# EAGLE design SnowFlake (EAGLE 9.6.2)
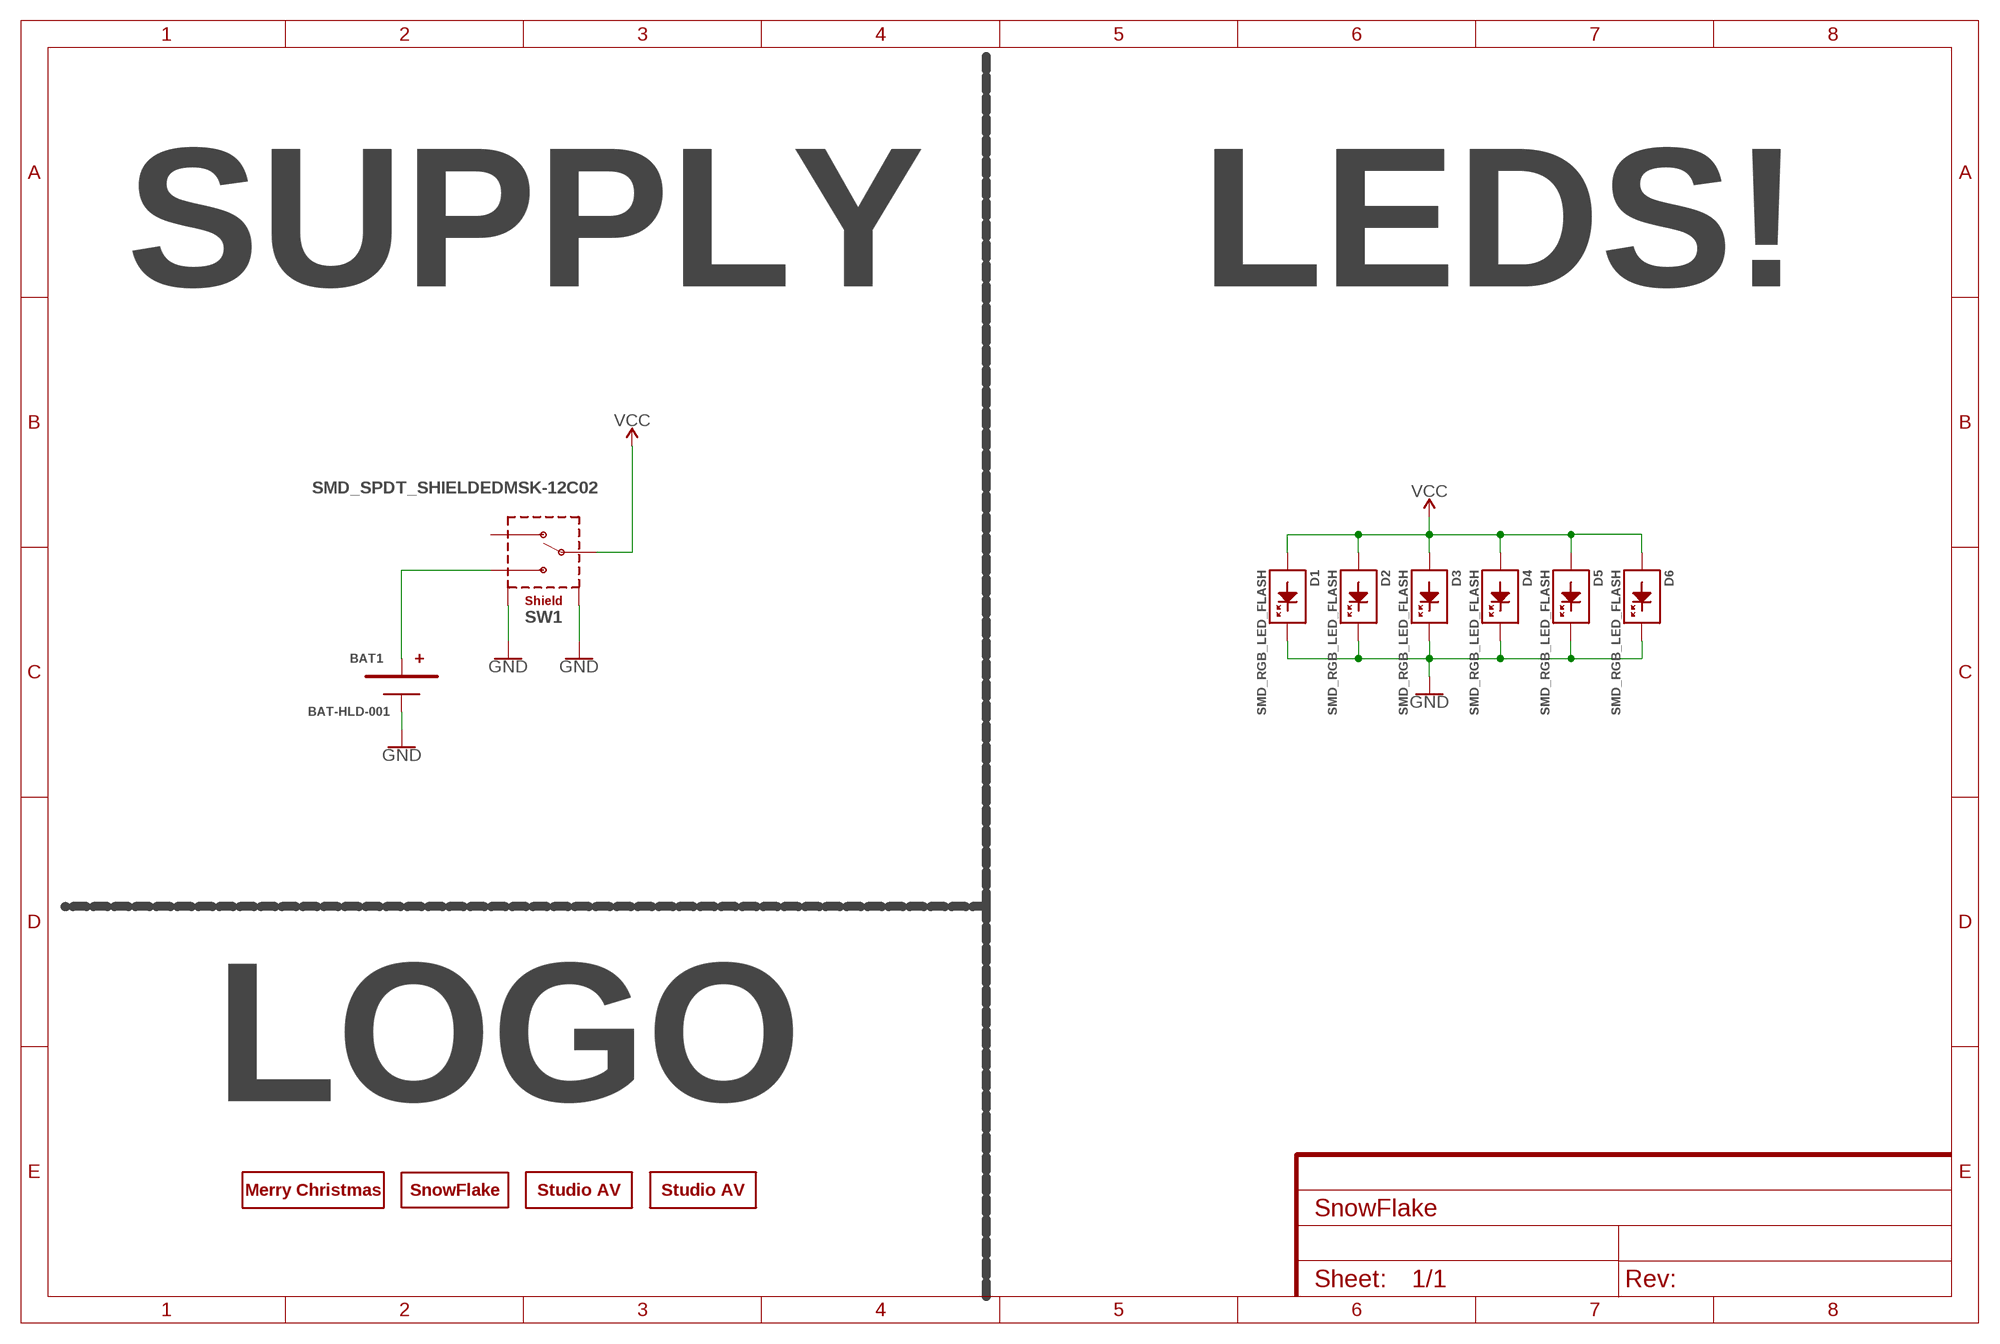
[diagram p0: schematic, sheet 1]

## Parts
BAT1  BAT-HLD-001  [BATHLD001]
D1  SMD_RGB_LED_FLASH  [SMD_RGB_LED_0807]
D2  SMD_RGB_LED_FLASH  [SMD_RGB_LED_0807]
D3  SMD_RGB_LED_FLASH  [SMD_RGB_LED_0807]
D4  SMD_RGB_LED_FLASH  [SMD_RGB_LED_0807]
D5  SMD_RGB_LED_FLASH  [SMD_RGB_LED_0807]
D6  SMD_RGB_LED_FLASH  [SMD_RGB_LED_0807]
SW1  SMD_SPDT_SHIELDEDMSK-12C02  [MSK-12C02]
U$1  MERRY_CHRISTMAS  [MERRY_CHRISTMAS]
U$2  STUDIO_AV-QR_CODE  [STUDIO_AV_QR]
U$3  STUDIO_AV-GENERAL  [STUDIO_AV]
U$4  SNOWFLAKE  [SNOWFLAKE]

## Nets
GND: BAT1.3(N) D1.3(K) D1.4(K) D2.3(K) D2.4(K) D3.3(K) D3.4(K) D4.3(K) D4.4(K) D5.3(K) D5.4(K) D6.3(K) D6.4(K) SW1.GND@1(S1) SW1.GND@2(S2) SW1.GND@3(S1) SW1.GND@4(S2)
N$2: BAT1.1(P) BAT1.2(P) SW1.L2(NO)
VCC: D1.1(A) D1.2(A) D2.1(A) D2.2(A) D3.1(A) D3.2(A) D4.1(A) D4.2(A) D5.1(A) D5.2(A) D6.1(A) D6.2(A) SW1.COM(C)
Unconnected: SW1.L1(NC)

## Notes on the sheet
- SUPPLY | LEDS!
- LOGO

## Library data of the parts
BAT1 = FL-Battery:BAT-HLD-001: Soporte para baterías de botón Linx CR2032 Battery Holder, Tape n Reel; DATASHEET: https://www.mouser.mx/datasheet/2/238/bat_hld_001-1659379.pdf; LCSC#PART: -; MANUFACTURER#PART: BAT-HLD-001-TR; MANUFACTURER_NAME: Linx Technologies; MOUSER#PART: 712-BAT-HLD-001-TR; PACKAGE: SMD
D1-D6 = FL-Led:SMD_RGB_LED_FLASH: 0807 RGB Led Lamp SMD, RGB Slow Flashing Diode, Colorful Diodes, DIY Flash; DATASHEET: https://es.aliexpress.com/item/32829140495.html?spm=a2g0s.9042311.0.0.32vRd6; LCSC#PART: -; MANUFACTURER#PART: -; MANUFACTURER_NAME: -; MOUSER#PART: -; PACKAGE: 0807
SW1 = FL-Switches:SMD_SPDT_SHIELDED: Interruptores corredizos SLIDE SWITCH SPDT Right Angle
U$1 = FL-Logo:MERRY_CHRISTMAS
U$2 U$3 = FL-Logo:STUDIO_AV
U$4 = FL-Boards:SNOWFLAKE

## Board
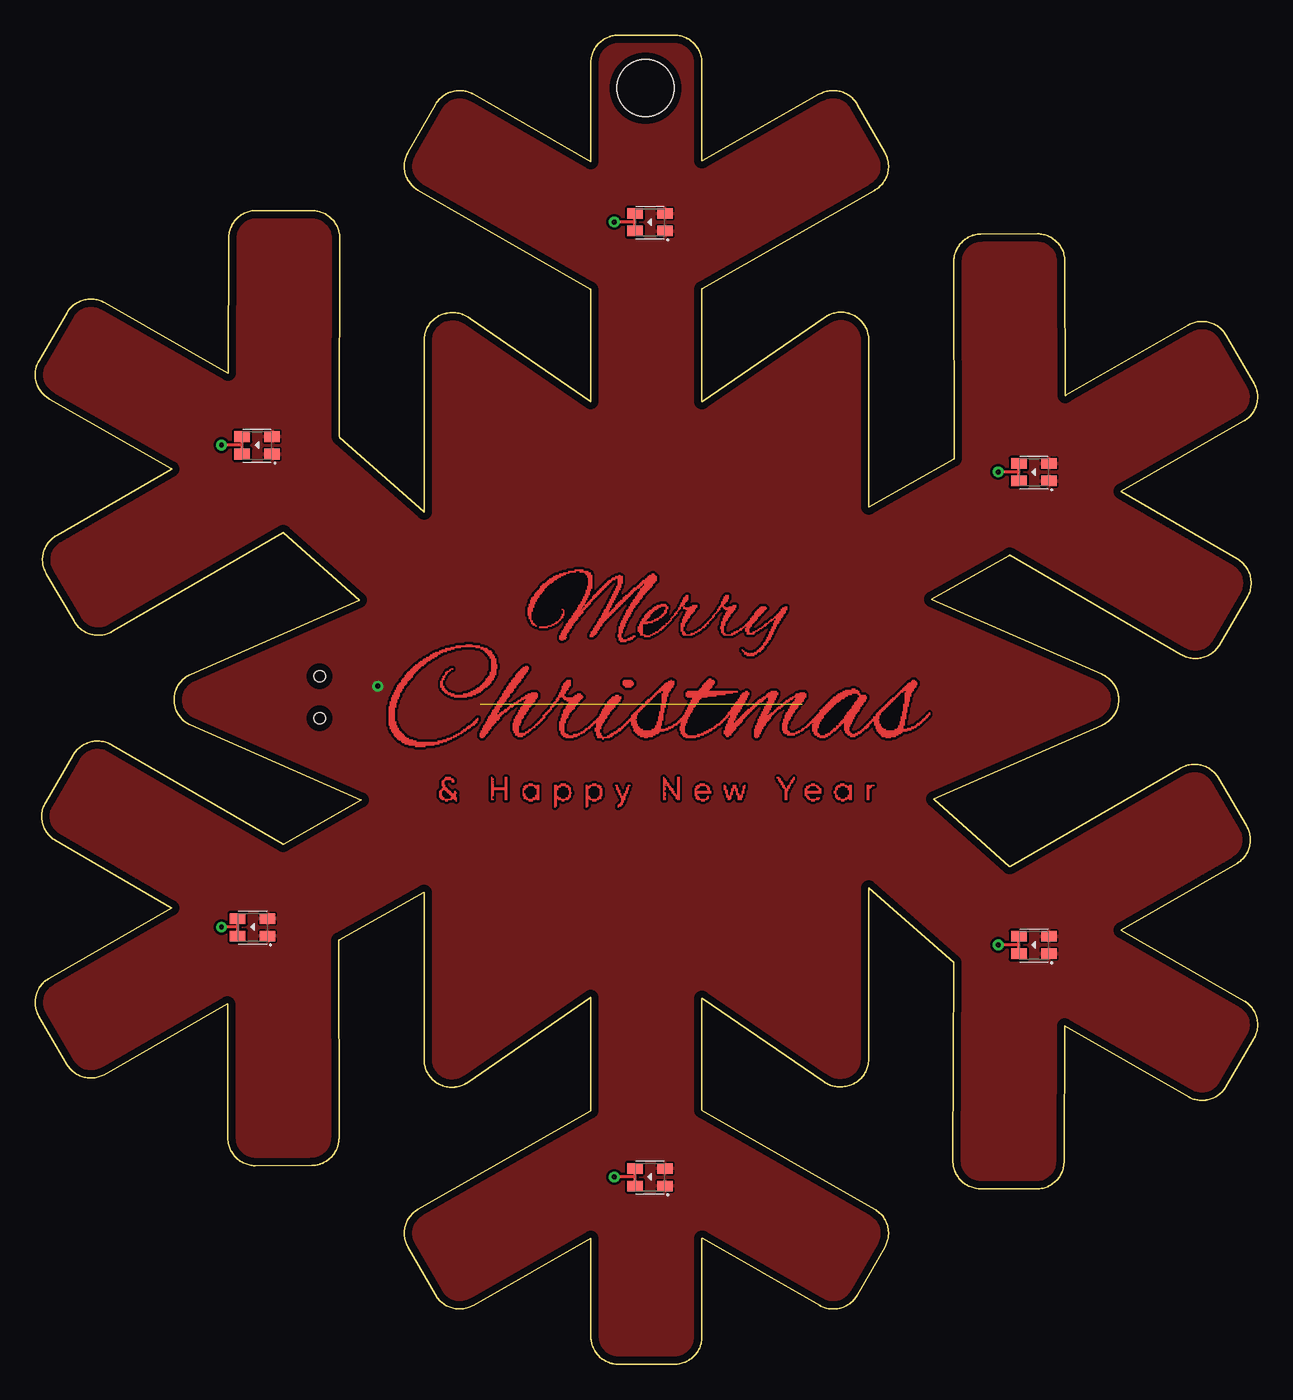
[diagram p1: board, top side]
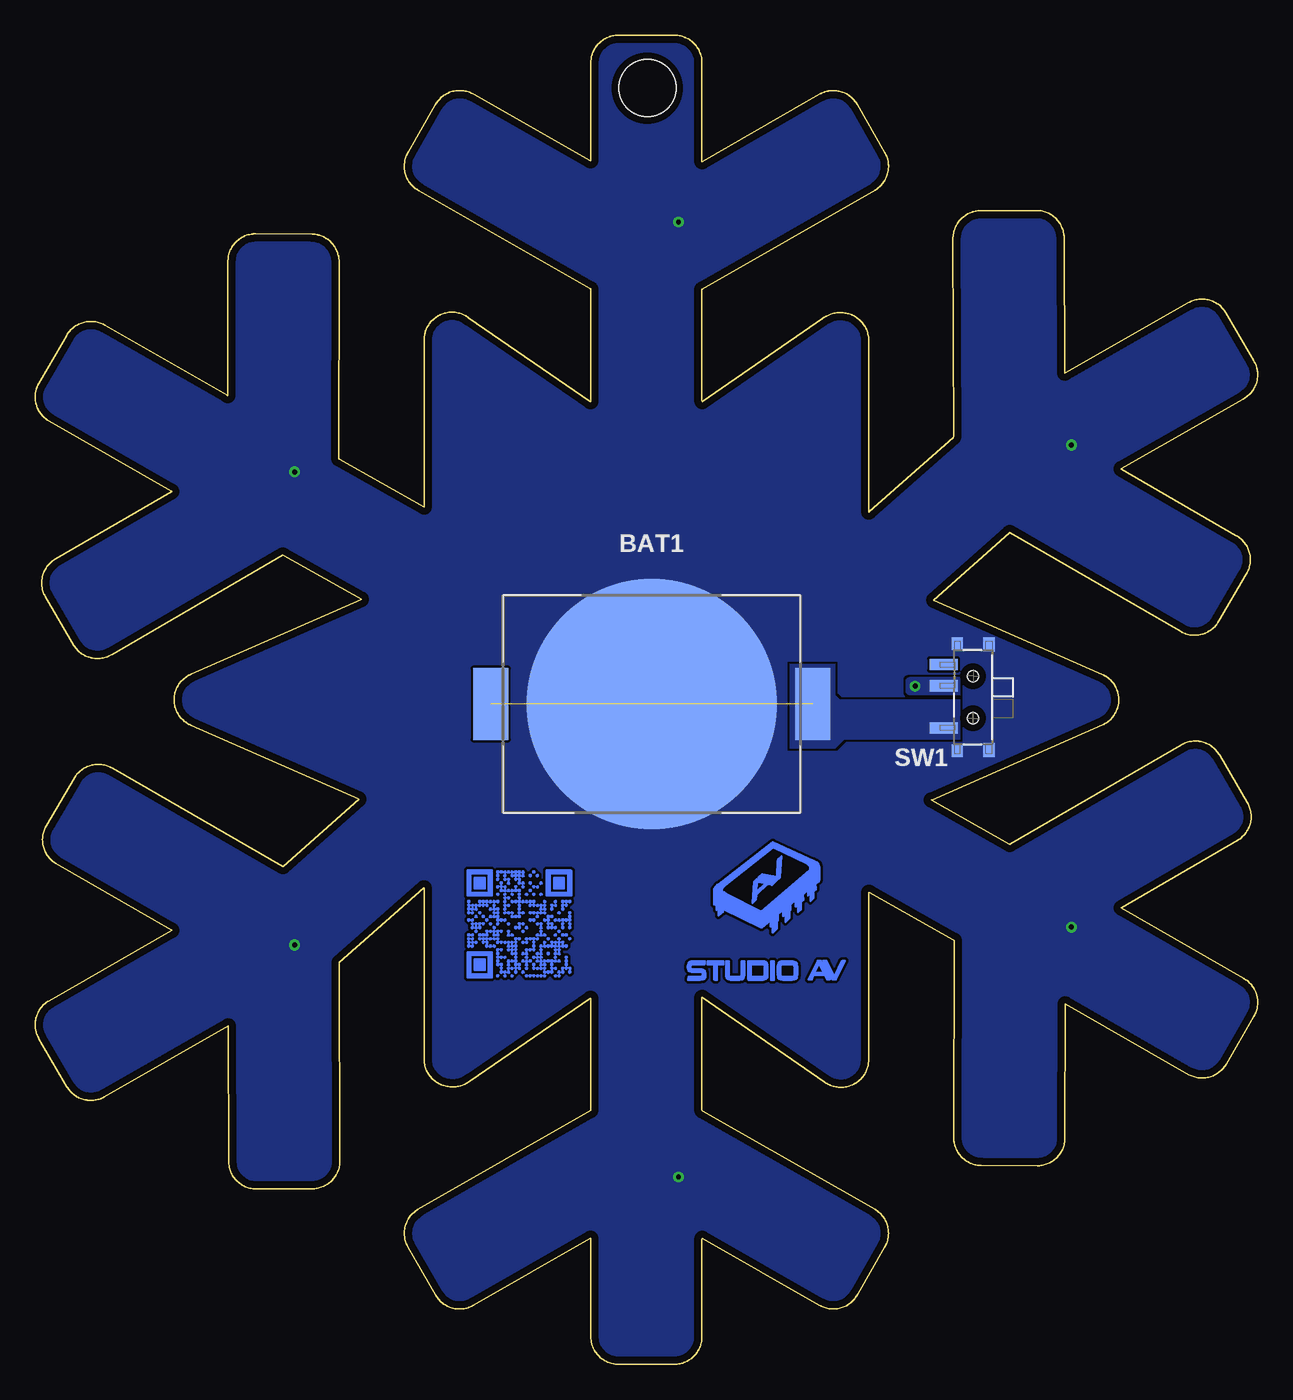
[diagram p2: board, bottom side, seen from below]

Size 86.96 x 94.58 mm. Coordinates in mm from the lower left corner, seen from the top.
Copper layers (1*16): Top 0.035mm / dielectric 1.5mm / Bottom 0.035mm
Design rules "PCB_QF_Robotics": minimum track width 8mil, minimum drill 0.35mm, track to track 7mil, track to pad 7mil, pad to pad 7mil, via to via 7mil, smd to smd 6mil, copper to edge 20mil, drill to drill 6mil, minimum pad ring 10mil, minimum via ring 8mil, stop-mask expansion 4mil, vias tented up to drill 20mil, thermal gap 5mil
Holes 4.06 mm at 43.42,90.81

### Footprints (pad centres in the part's own frame; a part is rotated, then mirrored left to right if it is on the bottom)
BATHLD001 = smd 2.5 x 5.1: 1 11.45,0; 2 -11.45,0 | smd 17.8 x 17.8: 3 0,0
SMD_RGB_LED_0807 = smd 1.1 x 0.75: 1 1.065,-0.635; 2 1.065,0.61; 3 -1.068,0.61; 4 -1.068,-0.635
MSK-12C02 = smd 0.8 x 2: COM 0.823,2.1; L1 2.323,2.1; L2 -2.177,2.1 | smd 1 x 0.8: GND@1 -3.75,-1.125; GND@4 3.75,-1.125 | smd 0.9 x 0.8: GND@2 -3.8,1.125; GND@3 3.8,1.125 | hole 0.8: -1.5,0; 1.5,0

### Placement (x,y rotation side)
BAT1  43.1,46.99 0 bottom
D1  15.48,31.12 0 top
D2  43.73,13.34 0 top
D3  71.04,29.85 0 top
D4  71.04,63.5 0 top
D5  43.73,81.28 0 top
D6  15.79,65.41 0 top
SW1  20.24,47.47 90 bottom
U$1  43.1,46.67 0 top
U$2  56.75,26.99 0 bottom
U$3  40.56,27.31 0 bottom
U$4  43.1,46.99 0 top

### Tracks (layer width: path | path; a pad name or v marks a point on that pad's centre or on a via)
GND  (via drill 0.35)
  Top 0.203: D6.4 14.73,65.41 | 14.73,65.41 D6.3 | 14.73,65.41 v13.25,65.41 | D1.4 14.41,31.12 | 14.41,31.12 D1.3 | 14.41,31.12 v13.25,31.12 | D2.3 42.67,13.34 | 42.67,13.34 D2.4 | 42.67,13.34 v41.19,13.34 | D3.4 69.97,29.85 | 69.97,29.85 D3.3 | 69.97,29.85 v68.5,29.85 | D4.4 69.97,63.5 | 69.97,63.5 D4.3 | 69.97,63.5 v68.5,63.5 | D5.4 42.67,81.28 | 42.67,81.28 D5.3 | 42.67,81.28 v41.19,81.28
  pour Bottom (rank 2, no thermals): -5.16,97.79 91.36,97.79 91.36,-3.81 -5.16,-3.81
N$2  (1 unrouted)
  pour Bottom (no thermals): 29.76,47.31 21.19,47.31 21.19,44.45 29.45,44.45 30.08,43.82 33.26,43.82 33.26,49.85 30.08,49.85 30.08,47.62
VCC  (via drill 0.35)
  other vias: 24.37,48.26
  pour Top: -5.16,-3.81 91.36,-3.81 91.36,80.01 91.36,97.79 43.1,97.79 -5.16,97.79
  pour Bottom (no thermals): 21.19,48.9 21.19,47.62 24.68,47.62 arc90 25,47.94 25,48.26 25,48.58 arc90 24.68,48.9

### Text on the board
Measures: Reference / Size